# EAGLE schematic mapleCUx_large_177 (EAGLE 7.3.0)
MAPLE-CUx Large Version
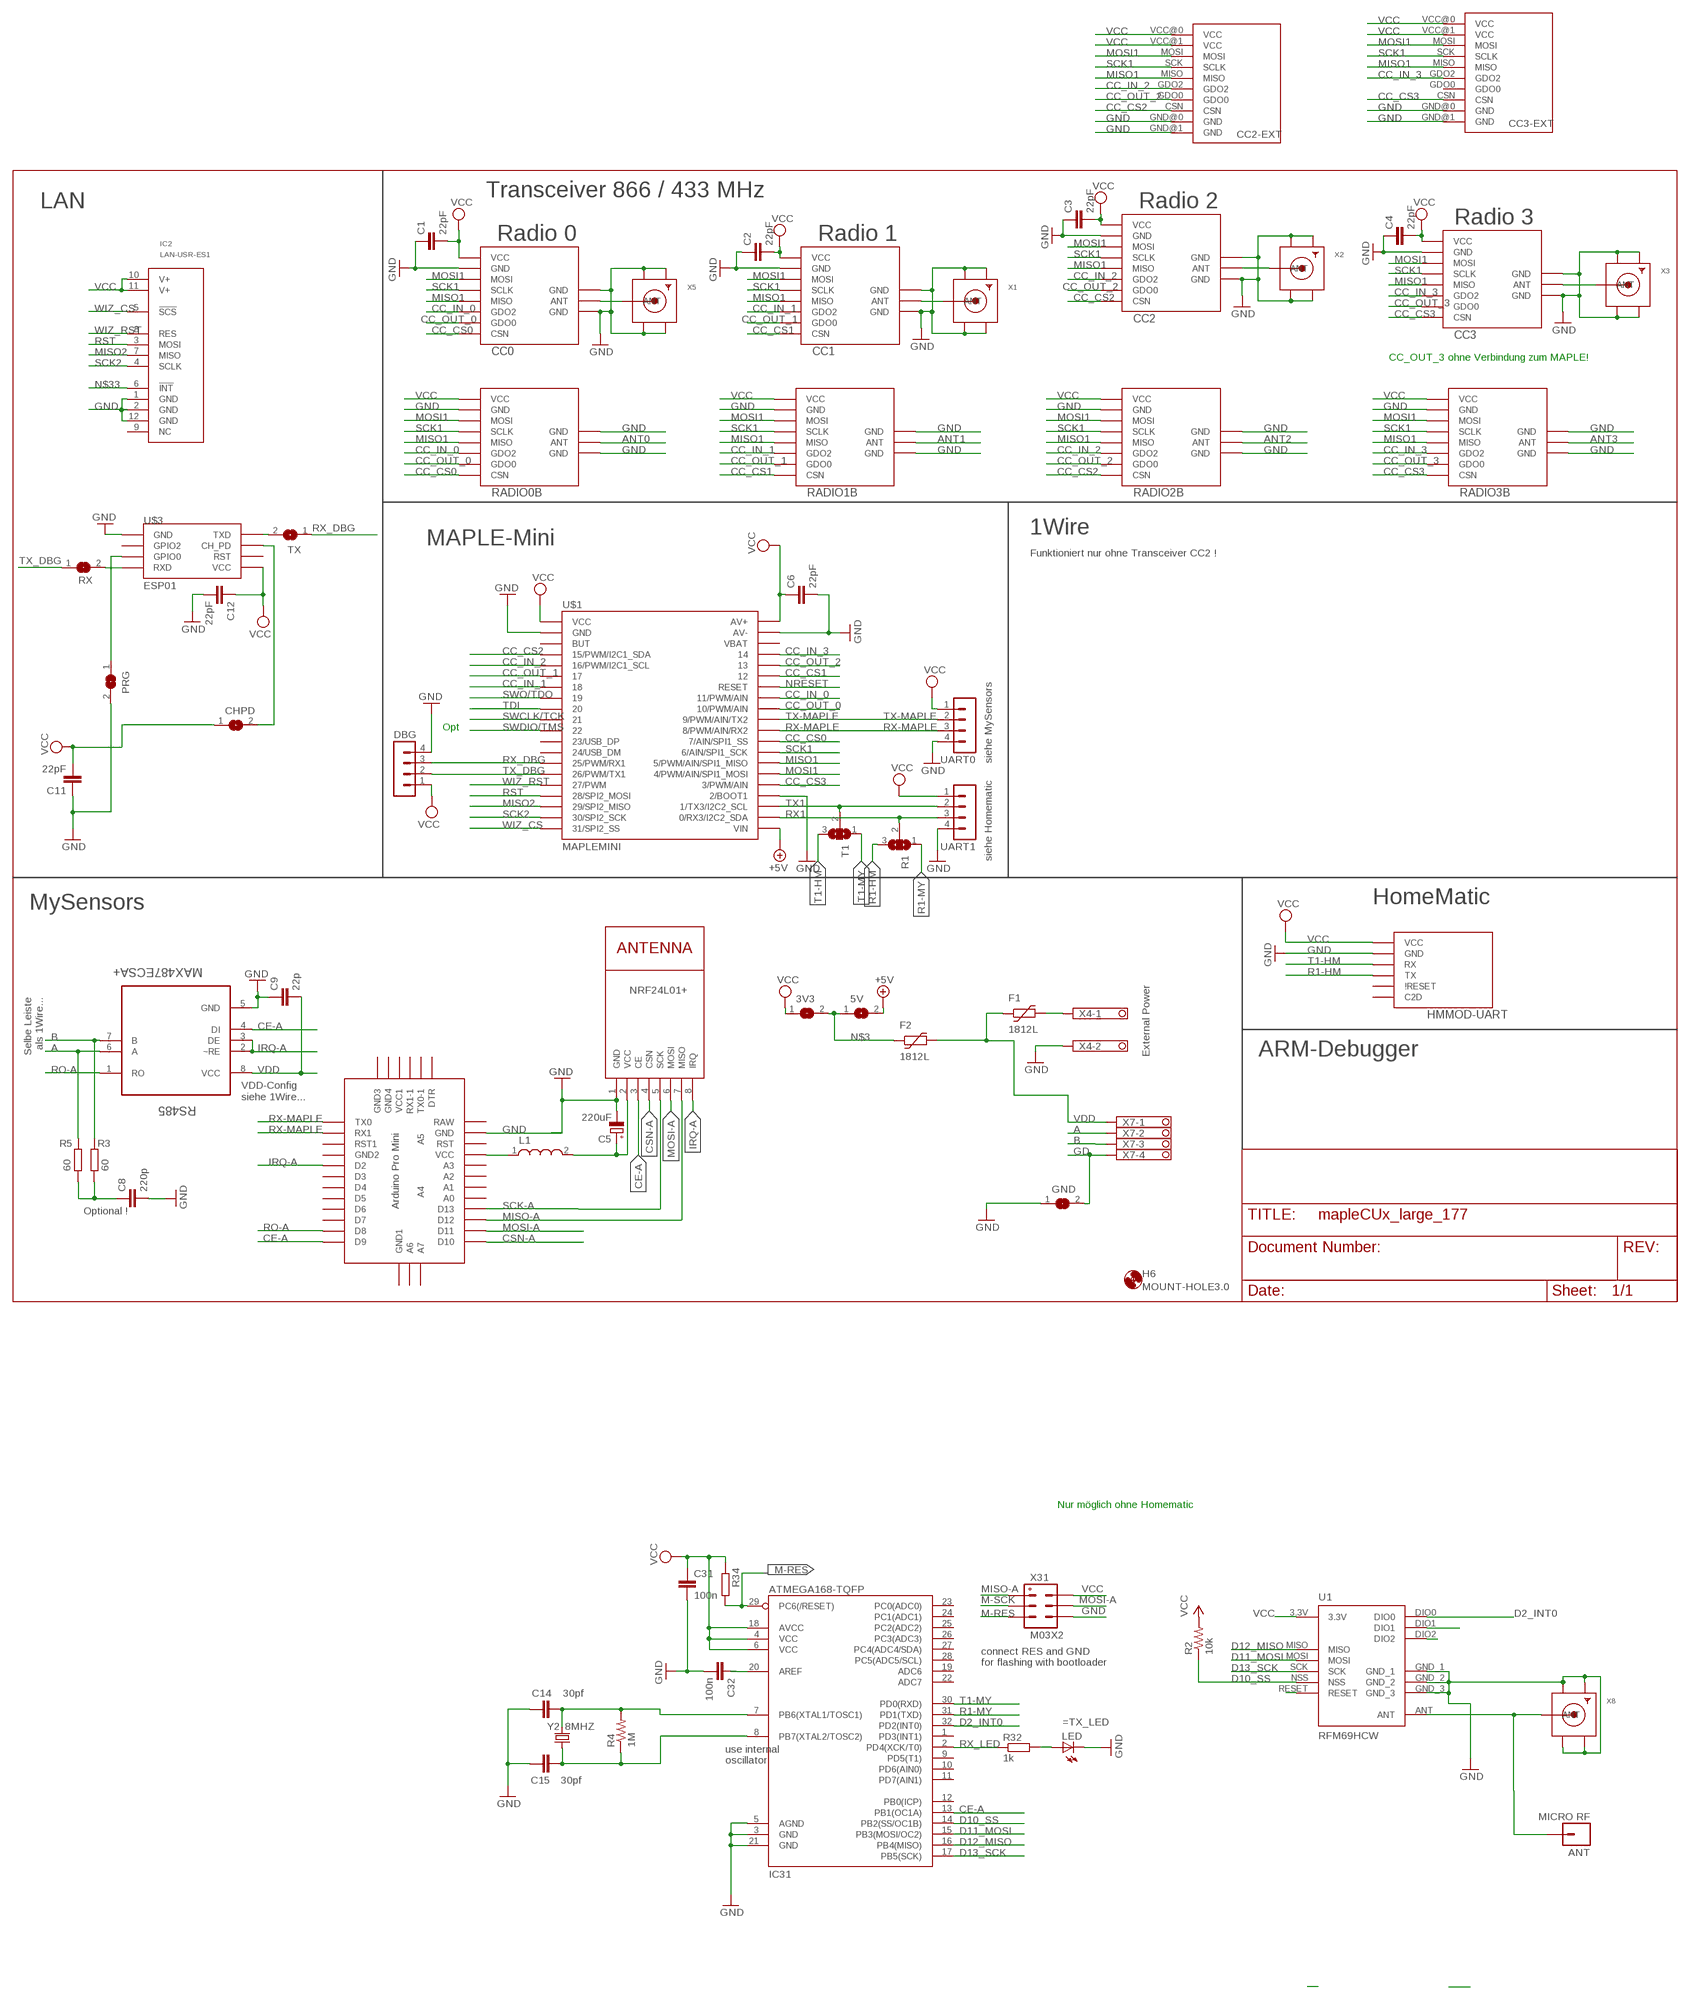
[diagram p0: schematic, sheet 1]

## Parts
3V3  SJ  [SJ]
5V  SJ  [SJ]
ANT  MICRO RF  M01PTH  [1X01]
C1  22pF  C-EUC0805  [C0805]
C2  22pF  C-EUC0805  [C0805]
C3  22pF  C-EUC0805  [C0805]
C4  22pF  C-EUC0805  [C0805]
C5  220uF  CPOL-EUE5-8.5  [E5-8,5]
C6  22pF  C-EUC0805  [C0805]
C8  220p  C-EUC0805  [C0805]
C9  22p  C-EUC0805  [C0805]
C11  22pF  C-EUC0805  [C0805]
C12  22pF  C-EUC0805  [C0805]
C14  30pf  CAP0805  [0805]
C15  30pf  CAP0805  [0805]
C31  100n  C-EUC0805  [C0805]
C32  100n  C-EUC0805  [C0805]
CC0  CC1101  CC1101_MODULE1SMD  [CC1101_MODULE1_SMD]
CC1  CC1101_MODULE1SMD  [CC1101_MODULE1_SMD]
CC2  CC1101_MODULE1SMD  [CC1101_MODULE1_SMD]
CC2-EXT  CC1101_MODULE3_DIL  [CC1101_MODULE3_DIL]
CC3  CC1101_MODULE1SMD  [CC1101_MODULE1_SMD]
CC3-EXT  CC1101_MODULE3_DIL  [CC1101_MODULE3_DIL]
CHPD  SJ  [SJ]
DBG  MA04-1  [MA04-1]
F1  1812L  [1812L]
F2  1812L  [1812L]
GND  SJ  [SJ]
H6  MOUNT-HOLE3.0  [3,0]
HMMOD-UART  HM-MOD-UARTDIL  [HM-MOD-UART-DIL]
IC2  LAN-USR-ES1  [USR-ES1]
IC31  ATMEGA168-TQFP  [TQFP32-08]
L1  WE-KI_0805A  [WE-KI_0805A]
LED  LEDCHIPLED_0805  [CHIPLED_0805]
NRF24L01+  NRF24L01+  WIRELESS-NRF24L01  [WIRELESS-NRF24L01]
PRG  SJ  [SJ]
R1  SJ2W  [SJ_2]
R2  10k  RESISTOR0805-RES  [0805]
R3  60  R-EU_R0805  [R0805]
R4  1M  RESISTOR0805-RES  [0805]
R5  60  R-EU_R0805  [R0805]
R32  1k  R-EU_R0805  [R0805]
R34  R-EU_R0805  [R0805]
RADIO0B  CC1101_MODULE1SMALL  [CC1101_MODULE1_SMD]
RADIO1B  CC1101_MODULE1SMALL  [CC1101_MODULE1_SMD]
RADIO2B  CC1101_MODULE1SMALL  [CC1101_MODULE1_SMD]
RADIO3B  CC1101_MODULE1SMALL  [CC1101_MODULE1_SMD]
RS485  MAX487ECSA+  [SOIC127P600X175-8N]
RX  SJ  [SJ]
T1  SJ2W  [SJ_2]
TX  SJ  [SJ]
U1  RFM69HCW  [RFM69HCW-XXXS2]
U$1  MAPLEMINI  [20-DIP]
U$2  ABK-PRO-MINI  [ABK-PRO-MINI]
U$3  ESP01  [ESP01]
UART0  MA04-1  [MA04-1]
UART1  MA04-1  [MA04-1]
X1  SMACONNECTOR_EDGE_UFL  [SMA_EDGELAUNCH_UFL]
X2  SMACONNECTOR_EDGE_UFL  [SMA_EDGELAUNCH_UFL]
X3  SMACONNECTOR_EDGE_UFL  [SMA_EDGELAUNCH_UFL]
X4  1751248  [1751248]
X5  SMACONNECTOR_EDGE_UFL  [SMA_EDGELAUNCH_UFL]
X7  1751264  [1751264]
X8  SMACONNECTOR_EDGE_UFL  [SMA_EDGELAUNCH_UFL]
X31  M03X2  [2X03-1.27MM_SMD]
Y2  8MHZ  CRYSTALTXC-7A  [CRYSTAL-TXC-7A]

## Nets
+5V [PWR]: 5V.2 U$1.21(VIN)
A: R5.2 RS485.6(A) X7.2
ANT: ANT.1 U1.ANT X8.P(ANT)
ANT0: CC0.ANT RADIO0B.ANT X5.P(ANT)
ANT1: CC1.ANT RADIO1B.ANT X1.P(ANT)
ANT2: CC2.ANT RADIO2B.ANT X2.P(ANT)
ANT3: CC3.ANT RADIO3B.ANT X3.P(ANT)
B: R3.2 RS485.7(B) X7.3
CC_CS0: CC0.CSN RADIO0B.CSN U$1.29(7/AIN/SPI1_SS)
CC_CS1: CC1.CSN RADIO1B.CSN U$1.35
CC_CS2: CC2-EXT.CSN CC2.CSN RADIO2B.CSN U$1.4(15/PWM/I2C1_SDA)
CC_CS3: CC3-EXT.CSN CC3.CSN RADIO3B.CSN U$1.25(3/PWM/AIN)
CC_IN_0: CC0.GDO2 RADIO0B.GDO2 U$1.33(11/PWM/AIN)
CC_IN_1: CC1.GDO2 RADIO1B.GDO2 U$1.7
CC_IN_2: CC2-EXT.GDO2 CC2.GDO2 RADIO2B.GDO2 U$1.5(16/PWM/I2C1_SCL)
CC_IN_3: CC3-EXT.GDO2 CC3.GDO2 RADIO3B.GDO2 U$1.37
CC_OUT_0: CC0.GDO0 RADIO0B.GDO0 U$1.32(10/PWM/AIN)
CC_OUT_1: CC1.GDO0 RADIO1B.GDO0 U$1.6
CC_OUT_2: CC2-EXT.GDO0 CC2.GDO0 RADIO2B.GDO0 U$1.36
CC_OUT_3: CC3.GDO0 RADIO3B.GDO0
CE-A: IC31.13(PB1(OC1A)) NRF24L01+.3(CE) RS485.4(DI) U$2.D9
CSN-A: NRF24L01+.4(CSN) U$2.D10
D2_INT0: IC31.32(PD2(INT0)) U1.DIO0
D10_SS: IC31.14(PB2(SS/OC1B)) R2.1 U1.NSS
D11_MOSI: IC31.15(PB3(MOSI/OC2)) U1.MOSI
D12_MISO: IC31.16(PB4(MISO)) U1.MISO
D13_SCK: IC31.17(PB5(SCK)) U1.SCK
E+ [PWR]: F1.P$2 X4.1
GD [PWR]: GND.2 X7.4
GND [PWR]: C1.1 C2.1 C3.1 C4.1 C5.- C6.2 C8.2 C9.1 C11.1 C12.2 C14.1 C15.1 C31.2 C32.2 CC0.GND@0(GND) CC0.GND@1(GND) CC0.GND@2(GND) CC1.GND@0(GND) CC1.GND@1(GND) CC1.GND@2(GND) CC2-EXT.GND@0(GND) CC2-EXT.GND@1(GND) CC2.GND@0(GND) CC2.GND@1(GND) CC2.GND@2(GND) CC3-EXT.GND@0(GND) CC3-EXT.GND@1(GND) CC3.GND@0(GND) CC3.GND@1(GND) CC3.GND@2(GND) DBG.4 GND.1 HMMOD-UART.2(GND) IC2.1(GND) IC2.2(GND) IC2.12(GND) IC31.3(GND) IC31.5(AGND) IC31.21(GND) LED.C NRF24L01+.1(GND) PRG.2 RADIO0B.GND@0(GND) RADIO0B.GND@1(GND) RADIO0B.GND@2(GND) RADIO1B.GND@0(GND) RADIO1B.GND@1(GND) RADIO1B.GND@2(GND) RADIO2B.GND@0(GND) RADIO2B.GND@1(GND) RADIO2B.GND@2(GND) RADIO3B.GND@0(GND) RADIO3B.GND@1(GND) RADIO3B.GND@2(GND) RS485.5(GND) U1.GND_1 U1.GND_2 U1.GND_3 U$1.2(GND) U$1.24(2/BOOT1) U$1.39(AV-) U$2.GND U$3.GND UART0.4 UART1.4 X1.GND@1(GND1) X1.GND@2(GND2) X1.GND@3(GND3) X1.GND@4(GND4) X2.GND@1(GND1) X2.GND@2(GND2) X2.GND@3(GND3) X2.GND@4(GND4) X3.GND@1(GND1) X3.GND@2(GND2) X3.GND@3(GND3) X3.GND@4(GND4) X4.2 X5.GND@1(GND1) X5.GND@2(GND2) X5.GND@3(GND3) X5.GND@4(GND4) X8.GND@1(GND1) X8.GND@2(GND2) X8.GND@3(GND3) X8.GND@4(GND4) X31.P$6
IRQ-A: NRF24L01+.8(IRQ) RS485.2(~RE) RS485.3(DE) U$2.D2
M-RES: IC31.29(PC6(/RESET)) R34.2 X31.P$5
M-SCK: X31.P$3
MISO1: CC0.MISO CC1.MISO CC2-EXT.MISO CC2.MISO CC3-EXT.MISO CC3.MISO RADIO0B.MISO RADIO1B.MISO RADIO2B.MISO RADIO3B.MISO U$1.27(5/PWM/AIN/SPI1_MISO)
MISO2: IC2.7(MISO) U$1.18(29/SPI2_MISO)
MISO-A: NRF24L01+.7(MISO) U$2.D12 X31.P$1
MOSI1: CC0.MOSI CC1.MOSI CC2-EXT.MOSI CC2.MOSI CC3-EXT.MOSI CC3.MOSI RADIO0B.MOSI RADIO1B.MOSI RADIO2B.MOSI RADIO3B.MOSI U$1.26(4/PWM/AIN/SPI1_MOSI)
MOSI-A: NRF24L01+.6(MOSI) U$2.D11 X31.P$4
N$1 [PWR]: C5.+ L1.2 NRF24L01+.2(VCC)
N$2: L1.1 U$2.VCC
N$3 [PWR]: 3V3.2 5V.1 F2.P$1
N$6: C14.2 IC31.7(PB6(XTAL1/TOSC1)) R4.2 Y2.P$2
N$8: RX.2 U$3.RX(RXD)
N$10: TX.2 U$3.TX(TXD)
N$11: PRG.1 U$3.GPIO0
N$12: CHPD.2 U$3.CH_PD
N$13: C32.1 IC31.20(AREF)
N$14: U1.DIO2
N$15: U1.DIO1
N$16: U1.RESET
N$18: LED.A R32.2
N$19: C15.2 IC31.8(PB7(XTAL2/TOSC2)) R4.1 Y2.P$1
N$21: C8.1 R3.1 R5.1
N$33: IC2.6(!INT!)
NRESET: U$1.34(RESET)
R1-HM: HMMOD-UART.5(TX) R1.3
R1-MY: IC31.31(PD1(TXD)) R1.1
RO-A: RS485.1(RO) U$2.D8
RST: IC2.3(MOSI) U$1.17(28/SPI2_MOSI)
RX1: R1.2 U$1.22(0/RX3/I2C2_SDA) UART1.3
RX-MAPLE: U$1.30(8/PWM/AIN/RX2) U$2.RX1 U$2.TX0 UART0.3
RX_DBG: DBG.3 TX.1 U$1.14(25/PWM/RX1)
RX_LED: IC31.2(PD4(XCK/T0)) R32.1
SCK1: CC0.SCLK CC1.SCLK CC2-EXT.SCK(SCLK) CC2.SCLK CC3-EXT.SCK(SCLK) CC3.SCLK RADIO0B.SCLK RADIO1B.SCLK RADIO2B.SCLK RADIO3B.SCLK U$1.28(6/AIN/SPI1_SCK)
SCK2: IC2.4(SCLK) U$1.19(30/SPI2_SCK)
SCK-A: NRF24L01+.5(SCK) U$2.D13
SWCLK/TCK: U$1.10
SWDIO/TMS: U$1.11
SWO/TDO: U$1.8
T1-HM: HMMOD-UART.6(RX) T1.3
T1-MY: IC31.30(PD0(RXD)) T1.1
TDI: U$1.9
TX1: T1.2 U$1.23(1/TX3/I2C2_SCL) UART1.2
TX-MAPLE: U$1.31(9/PWM/AIN/TX2) UART0.2
TX_DBG: DBG.2 RX.1 U$1.15(26/PWM/TX1)
VCC [PWR]: 3V3.1 C1.2 C2.2 C3.2 C4.2 C6.1 C11.2 C12.1 C31.1 CC0.VCC CC1.VCC CC2-EXT.VCC@0(VCC) CC2-EXT.VCC@1(VCC) CC2.VCC CC3-EXT.VCC@0(VCC) CC3-EXT.VCC@1(VCC) CC3.VCC CHPD.1 DBG.1 HMMOD-UART.1(VCC) IC2.10(V+) IC2.11(V+) IC31.4(VCC) IC31.6(VCC) IC31.18(AVCC) R2.2 R34.1 RADIO0B.VCC RADIO1B.VCC RADIO2B.VCC RADIO3B.VCC U1.3.3V U$1.1(VCC) U$1.40(AV+) U$3.VCC UART0.1 UART1.1 X31.P$2
VDD [PWR]: C9.2 F1.P$1 F2.P$2 RS485.8(VCC) X7.1
WIZ_CS: IC2.5(!SCS!) U$1.20(31/SPI2_SS)
WIZ_RST: IC2.8(RES) U$1.16(27/PWM)
Unconnected: CC3-EXT.GDO0 HMMOD-UART.3(C2D) HMMOD-UART.4(\!RESET) IC2.9(NC) IC31.1(PD3(INT1)) IC31.9(PD5(T1)) IC31.10(PD6(AIN0)) IC31.11(PD7(AIN1)) IC31.12(PB0(ICP)) IC31.19(ADC6) IC31.22(ADC7) IC31.23(PC0(ADC0)) IC31.24(PC1(ADC1)) IC31.25(PC2(ADC2)) IC31.26(PC3(ADC3)) IC31.27(PC4(ADC4/SDA)) IC31.28(PC5(ADC5/SCL)) U$1.3(BUT) U$1.12(23/USB_DP) U$1.13(24/USB_DM) U$1.38(VBAT) U$2.A0 U$2.A1 U$2.A2 U$2.A3 U$2.A4 U$2.A5 U$2.A6 U$2.A7 U$2.D3 U$2.D4 U$2.D5 U$2.D6 U$2.D7 U$2.DTR U$2.GND1(GND2) U$2.GND2(GND3) U$2.GND3(GND4) U$2.GND4(GND1) U$2.RAW U$2.RST U$2.RST1 U$2.RX1-1 U$2.TX0-1 U$2.VCC1 U$3.GPIO2 U$3.RST

## Notes on the sheet
- Transceiver 866 / 433 MHz
- LAN | Radio 2
- Radio 3
- Radio 0 | Radio 1
- CC_OUT_3 ohne Verbindung zum MAPLE!
- 1Wire
- MAPLE-Mini
- Funktioniert nur ohne Transceiver CC2 !
- Opt
- siehe MySensors
- siehe Homematic
- MySensors | HomeMatic
- Selbe Leiste
  als 1Wire...
- External Power | ARM-Debugger
- VDD-Config
  siehe 1Wire...
- Optional !
- Nur möglich ohne Homematic
- connect RES and GND
- for flashing with bootloader
- =TX_LED
- use internal
- oscillator

## Library data of the parts
3V3 5V CHPD GND PRG RX TX = jumper:SJ: SMD solder JUMPER
ANT = SparkFun-Connectors:M01: Header 1 Standard 1-pin 0.1" header. Use with straight break away headers (SKU : PRT-00116), right angle break away headers (PRT-00553), swiss pins (PRT-00743), machine pins (PRT-00117), and female headers (PRT-00115).
C1-C4 C6 C8 C9 C11 C12 C31 C32 = rcl:C-EU: CAPACITOR, European symbol
C5 = rcl:CPOL-EU: POLARIZED CAPACITOR, European symbol
C14 C15 = doug:CAP: Capacitor Standard 0603 ceramic capacitor, and 0.1" leaded capacitor.
CC0 CC1-CC3 = wireless:CC1101_MODULE1: CC1101 wireless module for 433/868 MHz (sold from Aliexpress). DIL version for mounting with pin header (and SMD soldering) and SMD only variant available.
CC2-EXT CC3-EXT = wireless:CC1101_MODULE3_DIL: 433 Mhz CC1101 wireless module named RF1101SE V3.1 package special has only limited silk screen on tPlace layer
DBG UART0 UART1 = con-lstb:MA04-1: PIN HEADER; OC_FARNELL: unknown; OC_NEWARK: unknown
F1 F2 = ptc-littlefuse:1812L
H6 = holes:MOUNT-HOLE: MOUNTING HOLE with drill center marker
HMMOD-UART = wireless:HM-MOD-UART: eQ3 HM-MOD-UART-AW-SH2 wireless module for 868 MHz. DIL version for mounting with pin header (antenna upwards) and SMD variant available (antenna downwards).
IC2 = Martin-Communication:LAN-USR-ES1
IC31 = atmel:ATMEGA168: Atmel Atmega 168/328/328P
L1 = EAGLE-EMC_COMPONENTS-rev17a:WE-KI: SMD Wire Wound Ceramic Inductor Characteristics WE-KI series offers you an excellent Q factor and highest possible self resonant frequencies up to 12.5 GHz Inductance tolerances: 5% (2% on request) High thermal stability Operating temperature: –40°C to +125°C Applications Especially developed for high frequency applications RF transceiver/communications Bluetooth Wireless LAN <http://katalog.we-online.de/media/images/v2/Family_WE-KI.jpg> Details see: http://katalog.we-online.de/en/pbs/WE-KI Updated by Dan Xu 2014-07-08 2014 (C) Wurth Elektronik
LED = led:LED: LED OSRAM: - CHIPLED LG R971, LG N971, LY N971, LG Q971, LY Q971, LO R971, LY R971 LH N974, LH R974 LS Q976, LO Q976, LY Q976 LO Q996 - Hyper CHIPLED LW Q18S LB Q993, LB Q99A, LB R99A - SideLED LS A670, LO A670, LY A670, LG A670, LP A670 LB A673, LV A673, LT A673, LW A673 LH A674 LY A675 LS A676, LA A676, LO A676, LY A676, LW A676 LS A679, LY A679, LG A679 - Hyper Micro SIDELED® LS Y876, LA Y876, LO Y876, LY Y876 LT Y87S - SmartLED LW L88C, LW L88S LB L89C, LB L89S, LG L890 LS L89K, LO L89K, LY L89K LS L896, LA L896, LO L896, LY L896 - TOPLED LS T670, LO T670, LY T670, LG T670, LP T670 LSG T670, LSP T670, LSY T670, LOP T670, LYG T670 LG T671, LOG T671, LSG T671 LB T673, LV T673, LT T673, LW T673 LH T674 LS T676, LA T676, LO T676, LY T676, LB T676, LH T676, LSB T676, LW T676 LB T67C, LV T67C, LT T67C, LS T67K, LO T67K, LY T67K, LW E67C LS E67B, LA E67B, LO E67B, LY E67B, LB E67C, LV E67C, LT E67C LW T67C LS T679, LY T679, LG T679 LS T770, LO T770, LY T770, LG T770, LP T770 LB T773, LV T773, LT T773, LW T773 LH T774 LS E675, LA E675, LY E675, LS T675 LS T776, LA T776, LO T776, LY T776, LB T776 LHGB T686 LT T68C, LB T68C - Hyper Mini TOPLED® LB M676 - Mini TOPLED Santana® LG M470 LS M47K, LO M47K, LY M47K Source: http://www.osram.convergy.de/
NRF24L01+ = diy-modules:WIRELESS-NRF24L01: 2.4 GHz Wireless Module based on NRF24L01 chip
R1 T1 = jumper:SJ2W: SMD solder JUMPER
R2 R4 = doug:RESISTOR: Resistor Basic schematic elements and footprints for 0603, 1206, and PTH resistors.
R3 R5 R32 R34 = rcl:R-EU_: RESISTOR, European symbol
RADIO0B RADIO1B RADIO2B RADIO3B = Martin-Communication:CC1101_MODULE1: CC1101 wireless module for 433/868 MHz (sold from Aliexpress). DIL version for mounting with pin header (and SMD soldering) and SMD only variant available.
RS485 = Maxim_By_element14_Batch_1:MAX487ECSA+: Low-Power, Slew-Rate-Limited RS-485/RS-422 Transceivers; MPN: MAX487ECSA+; OC_FARNELL: 9724532; OC_NEWARK: 68K4803; PACKAGE: SOIC-8; SUPPLIER: Maxim
U1 = doug:RFM69H
U$1 = maplemini-small:MAPLEMINI
U$2 = Arduino-clone:ABK-PRO-MINI: ABK Pro-Mini Arduino Clone
U$3 = esp8266modules:ESP01: ESP8266 Wifi module 01
X1-X3 X5 X8 = adafruit:SMACONNECTOR: SMA Connector 90° DIP SMA Connector, 50 Ohm (4UConnector: 07259)
X4 = con-phoenix-350:1751248: MKDS 1/ 2-3,5 Printklemme Nennstrom: 10 A Bemessungsspannung: 160 V Raster: 3,5 mm Polzahl: 2 Montageart: Löten Anschlussart: Schraubanschluss Anschlussrichtung vom Leiter zur Platine: 0° Source: http://eshop.phoenixcontact.com .. 1751248.pdf; OC_FARNELL: unknown; OC_NEWARK: unknown
X7 = con-phoenix-350:1751264: MKDS 1/ 4-3,5 Printklemme Nennstrom: 10 A Bemessungsspannung: 160 V Raster: 3,5 mm Polzahl: 4 Montageart: Löten Anschlussart: Schraubanschluss Anschlussrichtung vom Leiter zur Platine: 0° Source: http://eshop.phoenixcontact.com .. 1751264.pdf; MPN: 1751264; OC_FARNELL: unknown; OC_NEWARK: 10R0934
X31 = mechanics:M03X2
Y2 = SparkFun-FreqCtrl:CRYSTAL: Various standard crystals. Proven footprints.

## Net classes
0 default: width 0.305 mm
1 PWR: width 0.457 mm